# EAGLE design tricorder-featherwing-mk-1.2 (EAGLE 7.5.0)
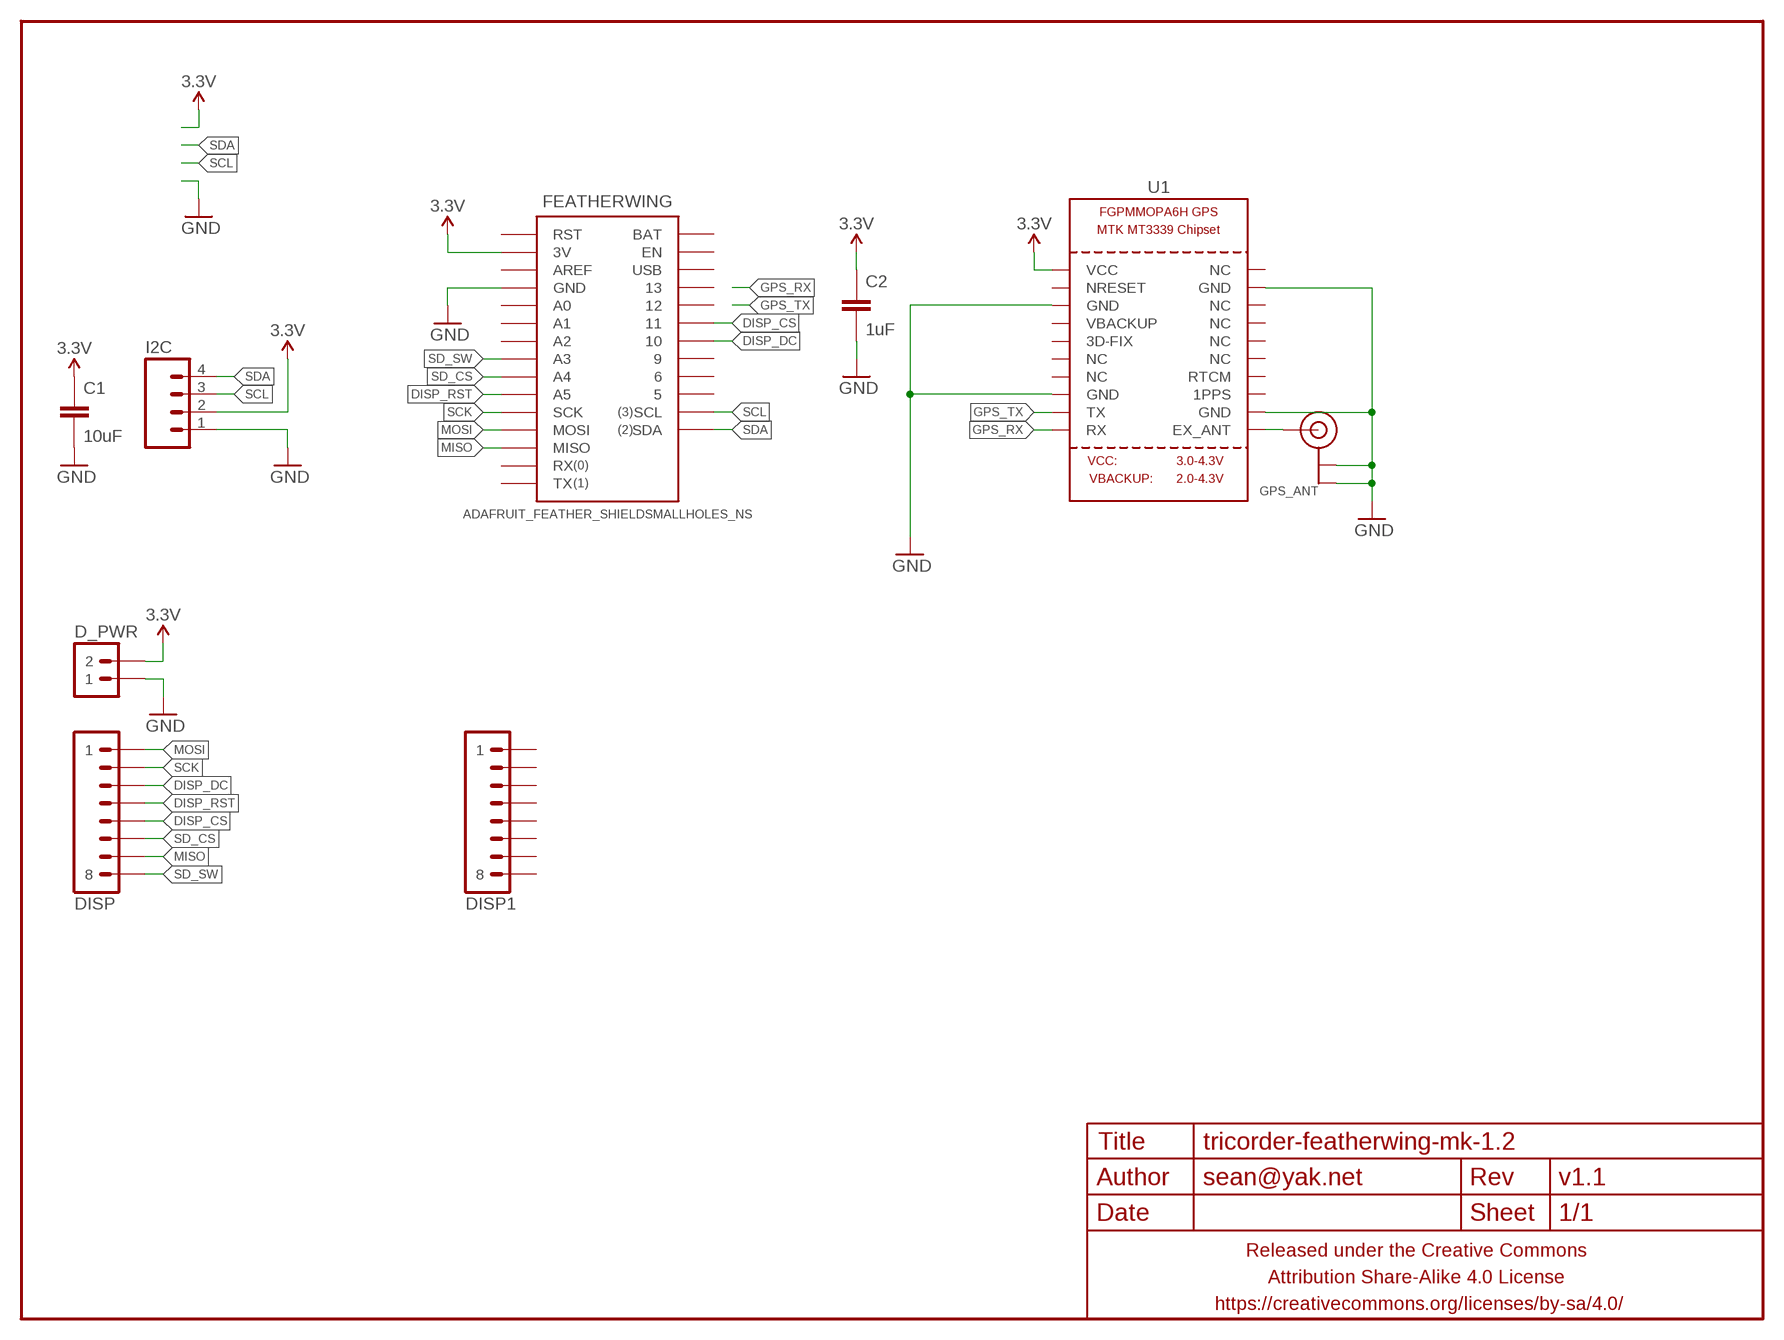
[diagram p0: schematic, sheet 1]

## Parts
C1  10uF  CAPACITOR-CERAMICC1210  [C1210]
C2  1uF  CAPACITOR-CERAMICC0603  [C0603]
D_PWR  M02PTH  [1X02]
DISP  M081X08  [1X08]
DISP1  M081X08  [1X08]
FEATHERWING  ADAFRUIT_FEATHER_SHIELDSMALLHOLES_NS  [ADAFRUIT_FEATHER_SMALLHOLES_NS]
FRAME1  FRAME-LETTERNO_PACKAGE  [DUMMY]
GPS_ANT  ANTENNA_U.FL  [U.FL]
I2C  M04PTH  [1X04-PTH-VERT]
U1  GPS_FGPMMOPA6H  [FGPMMOPA6H]

## Nets
3.3V: C1.1 C2.1 D_PWR.2 FEATHERWING.3V I2C.2 U1.P$1(VCC)
DISP_CS: DISP.5 FEATHERWING.11
DISP_DC: DISP.3 FEATHERWING.10
DISP_RST: DISP.4 FEATHERWING.A5
GND: C1.2 C2.2 D_PWR.1 FEATHERWING.GND@0(GND) FEATHERWING.GND@1(GND) GPS_ANT.1(GND) GPS_ANT.2(GND) I2C.1 U1.P$3(GND) U1.P$8(GND) U1.P$12(GND) U1.P$19(GND)
GPS_RX: U1.P$10(RX)
GPS_TX: U1.P$9(TX)
MISO: DISP.7 FEATHERWING.MISO
MOSI: DISP.1 FEATHERWING.MOSI
N$1: GPS_ANT.3(SIGNAL) U1.P$11(EX_ANT)
SCK: DISP.2 FEATHERWING.SCK
SCL: FEATHERWING.SCL I2C.3
SD_CS: DISP.6 FEATHERWING.A4
SD_SW: DISP.8 FEATHERWING.A3
SDA: FEATHERWING.SDA I2C.4
Unconnected: DISP1.1 DISP1.2 DISP1.3 DISP1.4 DISP1.5 DISP1.6 DISP1.7 DISP1.8 FEATHERWING.5 FEATHERWING.6 FEATHERWING.9 FEATHERWING.12 FEATHERWING.13 FEATHERWING.A0 FEATHERWING.A1 FEATHERWING.A2 FEATHERWING.AREF FEATHERWING.BAT FEATHERWING.EN FEATHERWING.RST FEATHERWING.RX FEATHERWING.TX FEATHERWING.USB U1.P$2(NRESET) U1.P$4(VBACKUP) U1.P$5(3D-FIX) U1.P$6(NC) U1.P$7(NC) U1.P$13(1PPS) U1.P$14(RTCM) U1.P$15(NC) U1.P$16(NC) U1.P$17(NC) U1.P$18(NC) U1.P$20(NC)

## Library data of the parts
C1 C2 = a_parts:CAPACITOR-CERAMIC: CAPACITOR, European symbol
D_PWR = a_parts:M02: Standard 2-pin 0.1" header. Use with - straight break away headers ( PRT-00116) - right angle break away headers (PRT-00553) - swiss pins (PRT-00743) - machine pins (PRT-00117) - female headers (PRT-00115) Molex polarized connector foot print use with: PRT-08233 with associated crimp pins and housings. 2.54_SCREWTERM for use with PRT-10571. 3.5mm Screw Terminal footprints for PRT-08084 5mm Screw Terminal footprints for use with PRT-08433
DISP DISP1 = a_parts:M08: Header 8 Standard 8-pin 0.1" header. Use with straight break away headers (SKU : PRT-00116), right angle break away headers (PRT-00553), swiss pins (PRT-00743), machine pins (PRT-00117), and female headers (PRT-00115).
FEATHERWING = a_parts:ADAFRUIT_FEATHER_SHIELD
FRAME1 = a_parts:FRAME-LETTER: Schematic Frame Standard 8.5x11 US Letter frame; DESIGNER: sean@yak.net; VERSION: v1.1
GPS_ANT = a_parts:ANTENNA_U.FL: U.FL Antenna Connector
I2C = a_parts:M04: Header 4 Standard 4-pin 0.1" header. Use with straight break away headers (SKU : PRT-00116), right angle break away headers (PRT-00553), swiss pins (PRT-00743), machine pins (PRT-00117), and female headers (PRT-00115). Molex polarized connector foot print use with SKU : PRT-08231 with associated crimp pins and housings. 1MM SMD Version SKU: PRT-10208
U1 = a_parts:GPS_FGPMMOPA6H: GPS Module - MTK MT3339 Chipset, -165dBm sensitivity, 22 channels, 10Hz, auto-select external antenna options

## Board
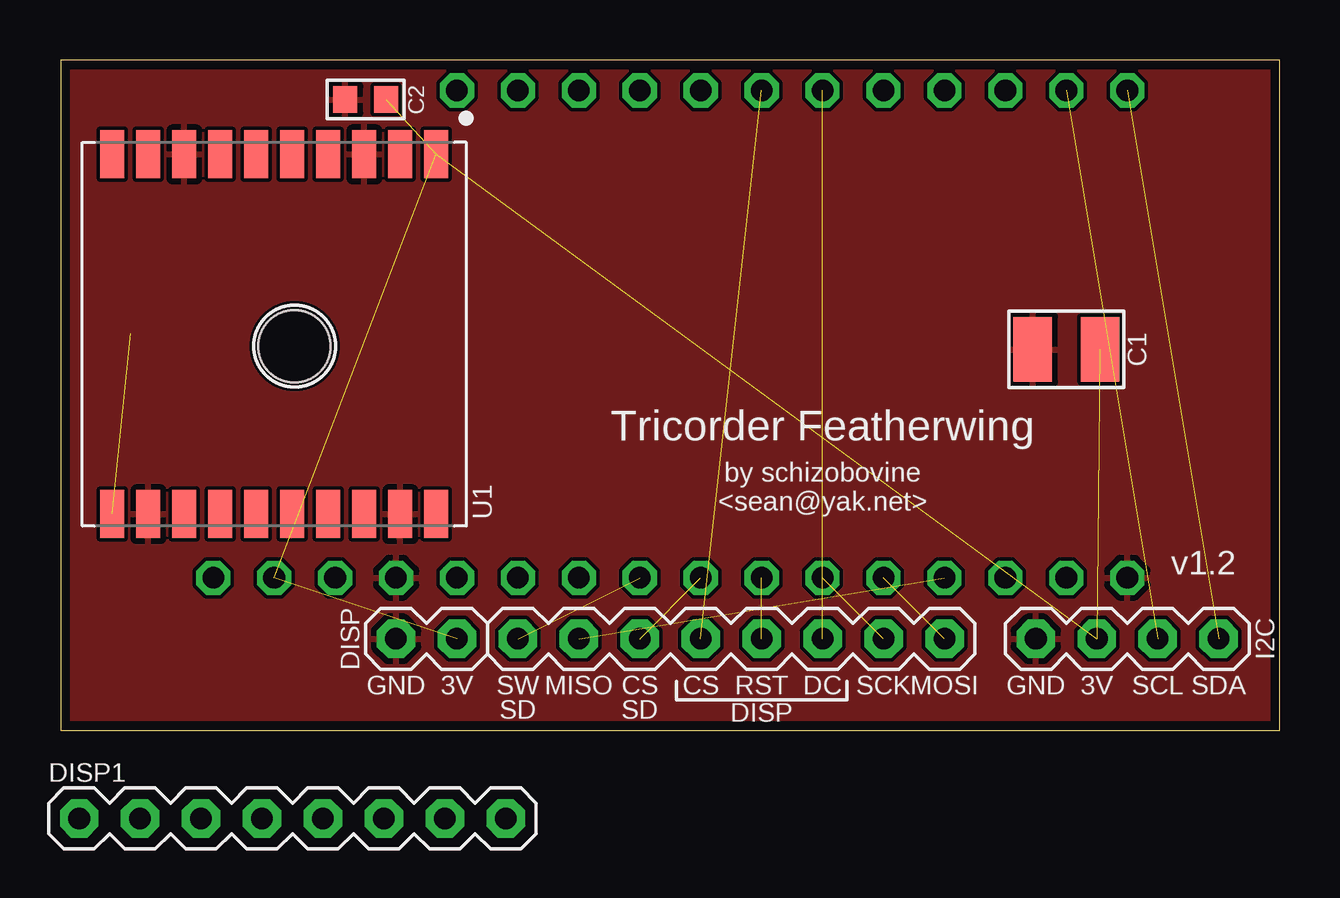
[diagram p1: board, top side]
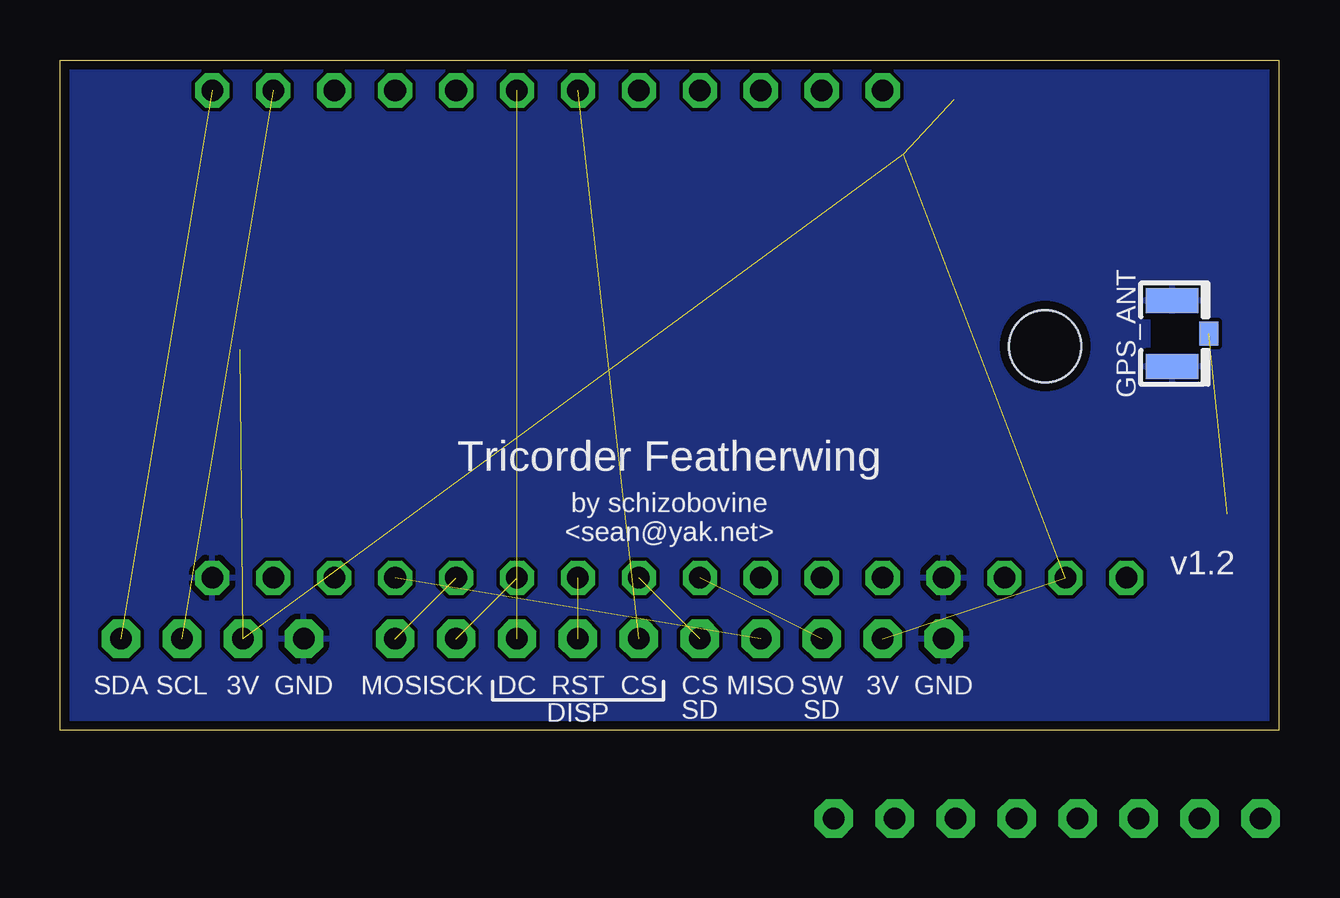
[diagram p2: board, bottom side, seen from below]

Size 50.8 x 27.94 mm. Coordinates in mm from the lower left corner, seen from the top.
Outline: 50.8,0 50.8,27.94 0,27.94 0,0 50.8,0
Copper layers (1*16): Top 0.0356mm / dielectric 1.5011mm / Bottom 0.0356mm
Design rules "LaenPCBOrder2": minimum track width 6mil, minimum drill 13mil, track to track 6mil, track to pad 6mil, pad to pad 6mil, via to via 6mil, smd to smd 6mil, copper to edge 15mil, drill to drill 6mil, minimum pad ring 7mil, minimum via ring 7mil, stop-mask expansion 3mil, vias tented up to drill 20mil, thermal gap 10mil

### Footprints (pad centres in the part's own frame; a part is rotated, then mirrored left to right if it is on the bottom)
C1210 = smd 1.6 x 2.7: 1 -1.4,0; 2 1.4,0
C0603 = smd 1 x 1.1: 1 -0.85,0; 2 0.85,0
1X02 = drill 0.9 pad 1.6 octagon: 1 0,0; 2 2.54,0
1X08 = drill 0.9 pad 1.6 octagon: 1 0,0; 2 2.54,0; 3 5.08,0; 4 7.62,0; 5 10.16,0; 6 12.7,0; 7 15.24,0; 8 17.78,0
ADAFRUIT_FEATHER_SMALLHOLES_NS = drill 0.9 pad 1.422 octagon: 3V -16.51,-10.16; 5 13.97,10.16; 6 11.43,10.16; 9 8.89,10.16; 10 6.35,10.16; 11 3.81,10.16; 12 1.27,10.16; 13 -1.27,10.16; A0 -8.89,-10.16; A1 -6.35,-10.16; A2 -3.81,-10.16; A3 -1.27,-10.16; A4 1.27,-10.16; A5 3.81,-10.16; AREF -13.97,-10.16; BAT -8.89,10.16; EN -6.35,10.16; GND@0 -11.43,-10.16; GND@1 19.05,-10.16; MISO 11.43,-10.16; MOSI 8.89,-10.16; RST -19.05,-10.16; RX 13.97,-10.16; SCK 6.35,-10.16; SCL 16.51,10.16; SDA 19.05,10.16; TX 16.51,-10.16; USB -3.81,10.16
U.FL = smd 2.2 x 1.05: 1 0,1.375; 2 0,-1.375 | smd 0.8 x 1: 3 1.525,0
1X04-PTH-VERT = drill 0.9 pad 1.6 octagon: 1 0,0; 2 2.54,0; 3 5.08,0; 4 7.62,0
FGPMMOPA6H = smd 2 x 1: P$1 -7.5,6.75; P$2 -7.5,5.25; P$3 -7.5,3.75; P$4 -7.5,2.25; P$5 -7.5,0.75; P$6 -7.5,-0.75; P$7 -7.5,-2.25; P$8 -7.5,-3.75; P$9 -7.5,-5.25; P$10 -7.5,-6.75; P$11 7.5,-6.75; P$12 7.5,-5.25; P$13 7.5,-3.75; P$14 7.5,-2.25; P$15 7.5,-0.75; P$16 7.5,0.75; P$17 7.5,2.25; P$18 7.5,3.75; P$19 7.5,5.25; P$20 7.5,6.75 | hole 3: 0.5,0.85

### Placement (x,y rotation side)
C1  41.91,15.88 180 top
C2  12.7,26.29 180 top
D_PWR  13.97,3.81 0 top
DISP  36.83,3.81 180 top
DISP1  0.76,-3.68 0 top  (outside the outline)
FEATHERWING  25.4,16.51 0 top
FRAME1  0,0 0 top
GPS_ANT  4.45,16.53 0 bottom
I2C  40.64,3.81 0 top
U1  8.89,16.51 270 top

### Tracks (layer width: path | path; a pad name or v marks a point on that pad's centre or on a via)
3.3V  (5 unrouted)
DISP_CS  (1 unrouted)
DISP_DC  (1 unrouted)
DISP_RST  (1 unrouted)
GND
  pour Bottom: 50.8,0 50.8,27.94 0,27.94 0,0
  pour Top: 50.8,0 50.8,27.94 0,27.94 0,0
MISO  (1 unrouted)
MOSI  (1 unrouted)
N$1  (1 unrouted)
SCK  (1 unrouted)
SCL  (1 unrouted)
SD_CS  (1 unrouted)
SD_SW  (1 unrouted)
SDA  (1 unrouted)

### Text on the board
tPlace: Tricorder Featherwing | by schizobovine / <sean@yak.net> | GND | 3V | SW | MISO | CS | CS | RST | DC | SCK | MOSI | GND | 3V | SCL | SDA | SD | SD | DISP
bPlace: Tricorder Featherwing | by schizobovine / <sean@yak.net> | GND | 3V | SW | MISO | CS | CS | RST | DC | SCK | MOSI | GND | 3V | SCL | SDA | SD | SD | DISP